# EAGLE schematic sitrep_display (EAGLE 7.7.0)
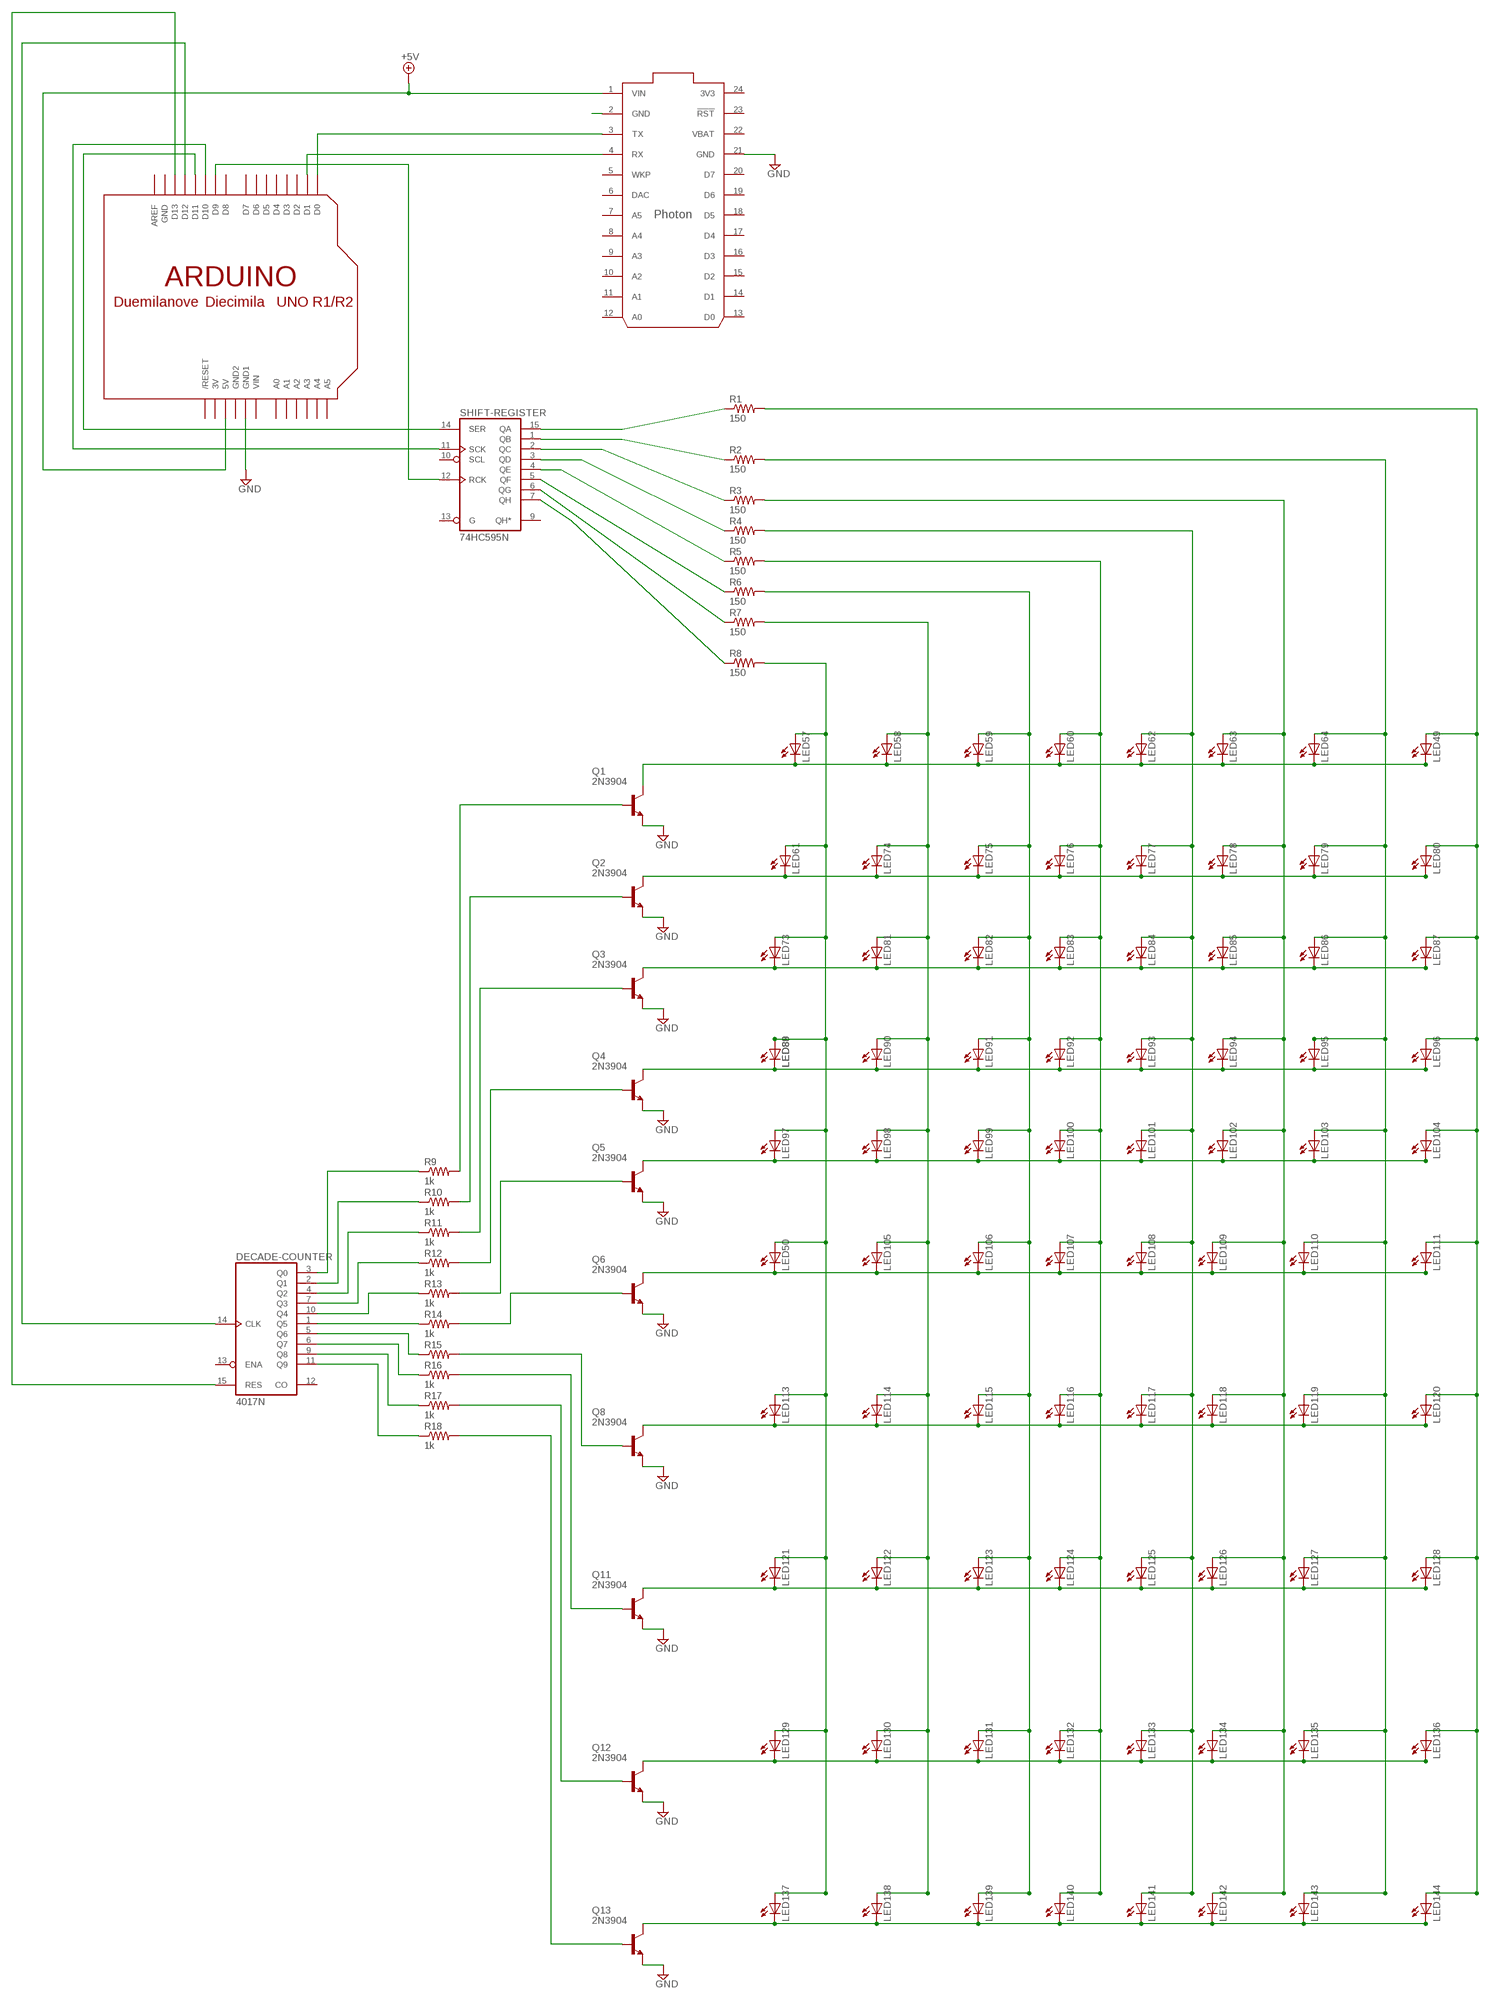
[diagram p0: schematic, sheet 1]

## Parts
DECADE-COUNTER  4017N  [DIL16]
LED49  LED5MM  [LED5MM]
LED50  LED5MM  [LED5MM]
LED57  LED5MM  [LED5MM]
LED58  LED5MM  [LED5MM]
LED59  LED5MM  [LED5MM]
LED60  LED5MM  [LED5MM]
LED61  LED5MM  [LED5MM]
LED62  LED5MM  [LED5MM]
LED63  LED5MM  [LED5MM]
LED64  LED5MM  [LED5MM]
LED73  LED5MM  [LED5MM]
LED74  LED5MM  [LED5MM]
LED75  LED5MM  [LED5MM]
LED76  LED5MM  [LED5MM]
LED77  LED5MM  [LED5MM]
LED78  LED5MM  [LED5MM]
LED79  LED5MM  [LED5MM]
LED80  LED5MM  [LED5MM]
LED81  LED5MM  [LED5MM]
LED82  LED5MM  [LED5MM]
LED83  LED5MM  [LED5MM]
LED84  LED5MM  [LED5MM]
LED85  LED5MM  [LED5MM]
LED86  LED5MM  [LED5MM]
LED87  LED5MM  [LED5MM]
LED88  LED5MM  [LED5MM]
LED89  LED5MM  [LED5MM]
LED90  LED5MM  [LED5MM]
LED91  LED5MM  [LED5MM]
LED92  LED5MM  [LED5MM]
LED93  LED5MM  [LED5MM]
LED94  LED5MM  [LED5MM]
LED95  LED5MM  [LED5MM]
LED96  LED5MM  [LED5MM]
LED97  LED5MM  [LED5MM]
LED98  LED5MM  [LED5MM]
LED99  LED5MM  [LED5MM]
LED100  LED5MM  [LED5MM]
LED101  LED5MM  [LED5MM]
LED102  LED5MM  [LED5MM]
LED103  LED5MM  [LED5MM]
LED104  LED5MM  [LED5MM]
LED105  LED5MM  [LED5MM]
LED106  LED5MM  [LED5MM]
LED107  LED5MM  [LED5MM]
LED108  LED5MM  [LED5MM]
LED109  LED5MM  [LED5MM]
LED110  LED5MM  [LED5MM]
LED111  LED5MM  [LED5MM]
LED113  LED5MM  [LED5MM]
LED114  LED5MM  [LED5MM]
LED115  LED5MM  [LED5MM]
LED116  LED5MM  [LED5MM]
LED117  LED5MM  [LED5MM]
LED118  LED5MM  [LED5MM]
LED119  LED5MM  [LED5MM]
LED120  LED5MM  [LED5MM]
LED121  LED5MM  [LED5MM]
LED122  LED5MM  [LED5MM]
LED123  LED5MM  [LED5MM]
LED124  LED5MM  [LED5MM]
LED125  LED5MM  [LED5MM]
LED126  LED5MM  [LED5MM]
LED127  LED5MM  [LED5MM]
LED128  LED5MM  [LED5MM]
LED129  LED5MM  [LED5MM]
LED130  LED5MM  [LED5MM]
LED131  LED5MM  [LED5MM]
LED132  LED5MM  [LED5MM]
LED133  LED5MM  [LED5MM]
LED134  LED5MM  [LED5MM]
LED135  LED5MM  [LED5MM]
LED136  LED5MM  [LED5MM]
LED137  LED5MM  [LED5MM]
LED138  LED5MM  [LED5MM]
LED139  LED5MM  [LED5MM]
LED140  LED5MM  [LED5MM]
LED141  LED5MM  [LED5MM]
LED142  LED5MM  [LED5MM]
LED143  LED5MM  [LED5MM]
LED144  LED5MM  [LED5MM]
Q1  2N3904  [TO92]
Q2  2N3904  [TO92]
Q3  2N3904  [TO92]
Q4  2N3904  [TO92]
Q5  2N3904  [TO92]
Q6  2N3904  [TO92]
Q8  2N3904  [TO92]
Q11  2N3904  [TO92]
Q12  2N3904  [TO92]
Q13  2N3904  [TO92]
R1  150  R-US_0207/2V  [0207/2V]
R2  150  R-US_0207/2V  [0207/2V]
R3  150  R-US_0207/2V  [0207/2V]
R4  150  R-US_0207/2V  [0207/2V]
R5  150  R-US_0207/2V  [0207/2V]
R6  150  R-US_0207/2V  [0207/2V]
R7  150  R-US_0207/2V  [0207/2V]
R8  150  R-US_0207/2V  [0207/2V]
R9  1k  R-US_0204/2V  [0204V]
R10  1k  R-US_0204/2V  [0204V]
R11  1k  R-US_0204/2V  [0204V]
R12  1k  R-US_0204/2V  [0204V]
R13  1k  R-US_0204/2V  [0204V]
R14  1k  R-US_0204/2V  [0204V]
R15  R-US_0204/2V  [0204V]
R16  1k  R-US_0204/2V  [0204V]
R17  1k  R-US_0204/2V  [0204V]
R18  1k  R-US_0204/2V  [0204V]
SHIFT-REGISTER  74HC595N  [DIL16]
U$1  PHOTON_WITH_HEADERS  [PHOTON]
U$2  ARDUINOUNO  [ARDUINO]

## Nets
+5V: U$1.1(VIN) U$2.5V
GND: Q1.3(E) Q2.3(E) Q3.3(E) Q4.3(E) Q5.3(E) Q6.3(E) Q8.3(E) Q11.3(E) Q12.3(E) Q13.3(E) U$1.21(GND) U$2.GND1
N$1: U$1.3(TX) U$2.D0
N$2: U$1.4(RX) U$2.D1
N$3: SHIFT-REGISTER.12(RCK) U$2.D9
N$4: SHIFT-REGISTER.11(SCK) U$2.D10
N$5: SHIFT-REGISTER.14(SER) U$2.D11
N$6: U$1.2(GND)
N$7: R1.1 SHIFT-REGISTER.15(QA)
N$8: R2.1 SHIFT-REGISTER.1(QB)
N$9: R3.1 SHIFT-REGISTER.2(QC)
N$10: R4.1 SHIFT-REGISTER.3(QD)
N$11: R5.1 SHIFT-REGISTER.4(QE)
N$12: R6.1 SHIFT-REGISTER.5(QF)
N$13: R7.1 SHIFT-REGISTER.6(QG)
N$14: R8.1 SHIFT-REGISTER.7(QH)
N$15: LED122.A
N$16: LED58.A LED74.A LED81.A LED90.A LED98.A LED105.A LED114.A R7.2
N$17: LED59.A LED75.A LED82.A LED91.A LED99.A LED106.A LED115.A R6.2
N$18: LED60.A LED76.A LED83.A LED92.A LED100.A LED107.A LED116.A R5.2
N$19: LED62.A LED77.A LED84.A LED93.A LED101.A LED108.A LED117.A R4.2
N$20: LED63.A LED78.A LED85.A LED94.A LED102.A LED109.A LED118.A R3.2
N$21: LED64.A LED79.A LED86.A LED95.A LED103.A LED110.A LED119.A R2.2
N$22: LED49.A LED80.A LED87.A LED96.A LED104.A LED111.A LED120.A R1.2
N$23: LED123.A
N$24: LED50.A LED57.A LED61.A LED73.A LED88.A LED89.A LED97.A LED113.A R8.2
N$25: LED124.A
N$26: LED125.A
N$27: LED126.A
N$28: LED127.A
N$29: LED103.K(C)
N$30: LED49.K(C) LED57.K(C) LED58.K(C) LED59.K(C) LED60.K(C) LED62.K(C) LED63.K(C) LED64.K(C) Q1.1(C)
N$31: LED61.K(C) LED74.K(C) LED75.K(C) LED76.K(C) LED77.K(C) LED78.K(C) LED79.K(C) LED80.K(C) Q2.1(C)
N$32: LED97.K(C) LED98.K(C) LED99.K(C) LED100.K(C) LED101.K(C) LED102.K(C) LED104.K(C) Q5.1(C)
N$33: LED88.K(C) LED89.K(C) LED90.K(C) LED91.K(C) LED92.K(C) LED93.K(C) LED94.K(C) LED95.K(C) LED96.K(C) Q4.1(C)
N$34: LED128.A
N$35: LED50.K(C) LED105.K(C) LED106.K(C) LED107.K(C) LED108.K(C) LED109.K(C) LED110.K(C) LED111.K(C) Q6.1(C)
N$36: LED121.A
N$37: LED113.K(C) LED114.K(C) LED115.K(C) LED116.K(C) LED117.K(C) LED118.K(C) LED119.K(C) LED120.K(C) Q8.1(C)
N$38: LED121.K(C) LED122.K(C) LED123.K(C) LED124.K(C) LED125.K(C) LED126.K(C) LED127.K(C) LED128.K(C) Q11.1(C)
N$39: LED73.K(C) LED81.K(C) LED82.K(C) LED83.K(C) LED84.K(C) LED85.K(C) LED86.K(C) LED87.K(C) Q3.1(C)
N$40: LED130.A
N$41: LED131.A
N$42: LED132.A
N$43: LED133.A
N$44: LED134.A
N$45: LED135.A
N$46: LED136.A
N$47: LED129.A
N$48: LED129.K(C) LED130.K(C) LED131.K(C) LED132.K(C) LED133.K(C) LED134.K(C) LED135.K(C) LED136.K(C) Q12.1(C)
N$49: LED138.A
N$50: LED139.A
N$51: LED140.A
N$52: LED141.A
N$53: LED142.A
N$54: LED143.A
N$55: LED144.A
N$56: LED137.A
N$57: LED137.K(C) LED138.K(C) LED139.K(C) LED140.K(C) LED141.K(C) LED142.K(C) LED143.K(C) LED144.K(C) Q13.1(C)
N$58: Q1.2(B) R9.2
N$59: Q2.2(B) R10.2
N$60: Q3.2(B) R11.2
N$61: Q4.2(B) R12.2
N$62: Q5.2(B) R13.2
N$63: Q6.2(B) R14.2
N$64: Q8.2(B) R15.2
N$65: Q11.2(B) R16.2
N$66: Q12.2(B) R17.2
N$67: Q13.2(B) R18.2
N$68: DECADE-COUNTER.3(Q0) R9.1
N$69: DECADE-COUNTER.2(Q1) R10.1
N$70: DECADE-COUNTER.4(Q2) R11.1
N$71: DECADE-COUNTER.7(Q3) R12.1
N$72: DECADE-COUNTER.10(Q4) R13.1
N$73: DECADE-COUNTER.1(Q5) R14.1
N$74: DECADE-COUNTER.5(Q6) R15.1
N$75: DECADE-COUNTER.6(Q7) R16.1
N$76: DECADE-COUNTER.9(Q8) R17.1
N$77: DECADE-COUNTER.11(Q9) R18.1
N$78: DECADE-COUNTER.14(CLK) U$2.D12
N$79: DECADE-COUNTER.15(RES) U$2.D13
Unconnected: DECADE-COUNTER.12(CO) DECADE-COUNTER.13(ENA) SHIFT-REGISTER.9(QH*) SHIFT-REGISTER.10(SCL) SHIFT-REGISTER.13(G) U$1.5(WKP) U$1.6(DAC) U$1.7(A5) U$1.8(A4) U$1.9(A3) U$1.10(A2) U$1.11(A1) U$1.12(A0) U$1.13(D0) U$1.14(D1) U$1.15(D2) U$1.16(D3) U$1.17(D4) U$1.18(D5) U$1.19(D6) U$1.20(D7) U$1.23(!RST) U$2.A0 U$2.A1 U$2.A2 U$2.A3 U$2.A4 U$2.A5 U$2.AREF U$2.D2 U$2.D3 U$2.D4 U$2.D5 U$2.D6 U$2.D7 U$2.D8 U$2.RESET(/RESET)

## Power pins joined to a net without a drawn wire
3V: U$2.3V
3V3: U$1.24(3V3)
GND: SHIFT-REGISTER.8(GND) U$2.GND
GND2: U$2.GND2
VBAT: U$1.22(VBAT)
VCC: SHIFT-REGISTER.16(VCC)
VDD: DECADE-COUNTER.16(VDD)
VIN: U$2.VIN
VSS: DECADE-COUNTER.8(VSS)

## Library data of the parts
DECADE-COUNTER = 40xx:4017: COUNTER/DIVIDER
LED49 LED50 LED57-LED64 LED73-LED111 LED113-LED144 = adafruit:LED: LED OSRAM: - CHIPLED LG R971, LG N971, LY N971, LG Q971, LY Q971, LO R971, LY R971 LH N974, LH R974 LS Q976, LO Q976, LY Q976 LO Q996 - Hyper CHIPLED LW Q18S LB Q993, LB Q99A, LB R99A - SideLED LS A670, LO A670, LY A670, LG A670, LP A670 LB A673, LV A673, LT A673, LW A673 LH A674 LY A675 LS A676, LA A676, LO A676, LY A676, LW A676 LS A679, LY A679, LG A679 - Hyper Micro SIDELED® LS Y876, LA Y876, LO Y876, LY Y876 LT Y87S - SmartLED LW L88C, LW L88S LB L89C, LB L89S, LG L890 LS L89K, LO L89K, LY L89K LS L896, LA L896, LO L896, LY L896 - TOPLED LS T670, LO T670, LY T670, LG T670, LP T670 LSG T670, LSP T670, LSY T670, LOP T670, LYG T670 LG T671, LOG T671, LSG T671 LB T673, LV T673, LT T673, LW T673 LH T674 LS T676, LA T676, LO T676, LY T676, LB T676, LH T676, LSB T676, LW T676 LB T67C, LV T67C, LT T67C, LS T67K, LO T67K, LY T67K, LW E67C LS E67B, LA E67B, LO E67B, LY E67B, LB E67C, LV E67C, LT E67C LW T67C LS T679, LY T679, LG T679 LS T770, LO T770, LY T770, LG T770, LP T770 LB T773, LV T773, LT T773, LW T773 LH T774 LS E675, LA E675, LY E675, LS T675 LS T776, LA T776, LO T776, LY T776, LB T776 LHGB T686 LT T68C, LB T68C - Hyper Mini TOPLED® LB M676 - Mini TOPLED Santana® LG M470 LS M47K, LO M47K, LY M47K Source: http://www.osram.convergy.de/
Q1-Q6 Q8 Q11-Q13 = transistor-npn:2N3904: NPN Transistor
R1-R8 = adafruit:R-US_: RESISTOR, American symbol
R9-R18 = resistor:R-US_: RESISTOR, American symbol
SHIFT-REGISTER = 74xx-eu:74*595: 8-bit SHIFT REGISTER, output latch
U$1 = Particle-Devices:PHOTON: Particle Photon Wi-Fi through-hole development board footprint
U$2 = adafruit:ARDUINO: Arduino Diecimila/Duemilanove Make a shield with ease, this package has all the named pins as well as the two mounting drill holes and an outline of the USB and DC power connector. The outline is on the DIMENSION layer, so if your board house uses it they will cut the outline to match. http://www.ladyada.net/library/pcb/eaglelibrary.html